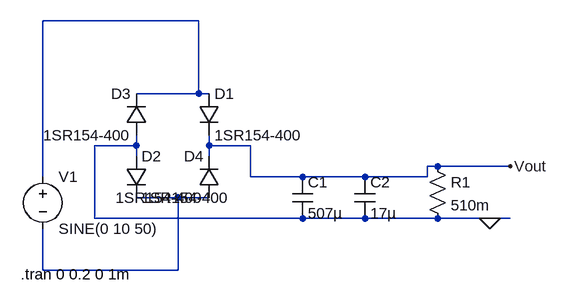
[diagram p0: schematic MuE_Set_1_new.asc]
MuE_Set_1_new.asc, the LTspice schematic file:
Version 4
SHEET 1 880 680
WIRE 192 -112 -48 -112
WIRE 192 0 192 -112
WIRE 192 0 96 0
WIRE 208 0 192 0
WIRE 96 80 96 64
WIRE 96 80 32 80
WIRE 208 80 208 64
WIRE 272 80 208 80
WIRE 96 96 96 80
WIRE 208 96 208 80
WIRE 560 112 544 112
WIRE 672 112 560 112
WIRE -48 128 -48 -112
WIRE 272 128 272 80
WIRE 352 128 272 128
WIRE 448 128 352 128
WIRE 544 128 544 112
WIRE 544 128 448 128
WIRE 160 160 96 160
WIRE 208 160 160 160
WIRE 32 192 32 80
WIRE 352 192 32 192
WIRE 448 192 352 192
WIRE 560 192 448 192
WIRE 640 192 560 192
WIRE 672 192 640 192
WIRE -48 272 -48 208
WIRE 160 272 160 160
WIRE 160 272 -48 272
FLAG 640 192 0
FLAG 672 112 Vout
SYMBOL voltage -48 112 R0
WINDOW 123 0 0 Left 0
WINDOW 39 0 0 Left 0
SYMATTR InstName V1
SYMATTR Value SINE(0 10 50)
SYMBOL cap 336 128 R0
SYMATTR InstName C1
SYMATTR Value 507µ
SYMBOL cap 432 128 R0
SYMATTR InstName C2
SYMATTR Value 17µ
SYMBOL res 544 96 R0
SYMATTR InstName R1
SYMATTR Value 510m
SYMBOL diode 192 0 R0
SYMATTR InstName D1
SYMATTR Value 1SR154-400
SYMBOL diode 80 96 R0
SYMATTR InstName D2
SYMATTR Value 1SR154-400
SYMBOL diode 112 64 R180
WINDOW 0 24 64 Left 2
WINDOW 3 24 0 Left 2
SYMATTR InstName D3
SYMATTR Value 1SR154-400
SYMBOL diode 224 160 R180
WINDOW 0 24 64 Left 2
WINDOW 3 24 0 Left 2
SYMATTR InstName D4
SYMATTR Value 1SR154-400
TEXT -82 278 Left 2 !.tran 0 0.2 0 1m

The netlist it stands for:
* MuE_Set_1_new.asc
V1 N001 N002 SINE(0 10 50)
C1 Vout 0 507µ
C2 Vout 0 17µ
R1 Vout 0 510m
D1 N001 Vout 1SR154-400
D2 0 N002 1SR154-400
D3 0 N001 1SR154-400
D4 N002 Vout 1SR154-400
.model D D
.lib standard.dio
.tran 0 0.2 0 1m
.backanno
.end